# EAGLE design m1-ram (EAGLE 9.5.2)
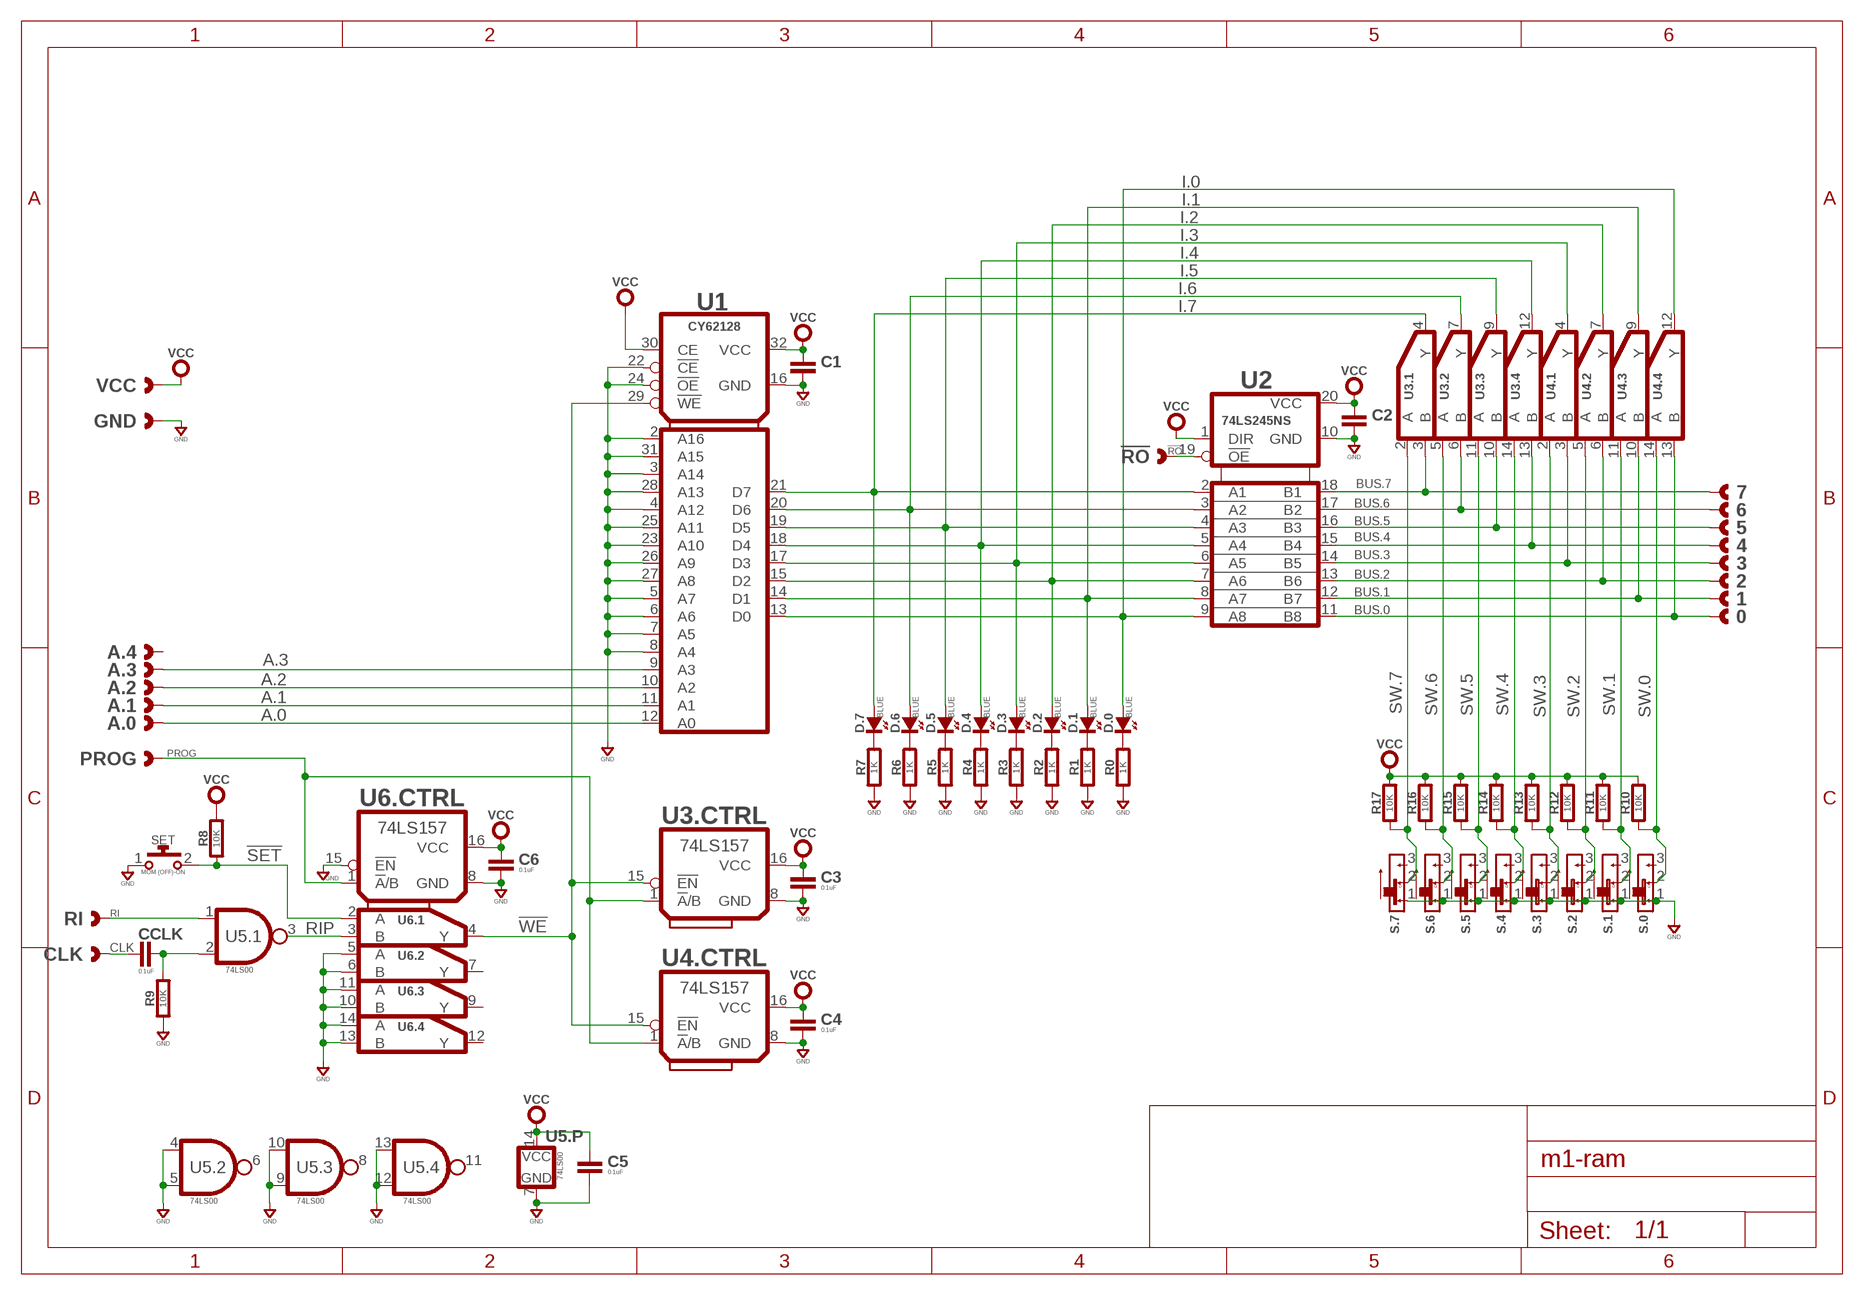
[diagram p0: schematic, sheet 1]

## Parts
0  CAST-01X1  [CAST01-2.54MM]
1  CAST-01X1  [CAST01-2.54MM]
2  CAST-01X1  [CAST01-2.54MM]
3  CAST-01X1  [CAST01-2.54MM]
4  CAST-01X1  [CAST01-2.54MM]
5  CAST-01X1  [CAST01-2.54MM]
6  CAST-01X1  [CAST01-2.54MM]
7  CAST-01X1  [CAST01-2.54MM]
!RO  CAST-01X1  [CAST01-2.54MM]
A.0  CAST-01X1  [CAST01-2.54MM]
A.1  CAST-01X1  [CAST01-2.54MM]
A.2  CAST-01X1  [CAST01-2.54MM]
A.3  CAST-01X1  [CAST01-2.54MM]
A.4  CAST-01X1  [CAST01-2.54MM]
C1  CAPACITOR0603  [0603-CAP]
C2  CAPACITOR0603  [0603-CAP]
C3  0.1uF  CAPACITOR0603  [0603-CAP]
C4  0.1uF  CAPACITOR0603  [0603-CAP]
C5  0.1uF  CAPACITOR0603  [0603-CAP]
C6  0.1uF  CAPACITOR0603  [0603-CAP]
CCLK  0.1uF  CAPACITOR0603  [0603-CAP]
CLK  CAST-01X1  [CAST01-2.54MM]
D.0  BLUE  SMT0603  [SMD_0603]
D.1  BLUE  SMT0603  [SMD_0603]
D.2  BLUE  SMT0603  [SMD_0603]
D.3  BLUE  SMT0603  [SMD_0603]
D.4  BLUE  SMT0603  [SMD_0603]
D.5  BLUE  SMT0603  [SMD_0603]
D.6  BLUE  SMT0603  [SMD_0603]
D.7  BLUE  SMT0603  [SMD_0603]
GND  CAST-01X1  [CAST01-2.54MM]
PROG  CAST-01X1  [CAST01-2.54MM]
R0  1K  RESISTOR0603  [0603-RES]
R1  1K  RESISTOR0603  [0603-RES]
R2  1K  RESISTOR0603  [0603-RES]
R3  1K  RESISTOR0603  [0603-RES]
R4  1K  RESISTOR0603  [0603-RES]
R5  1K  RESISTOR0603  [0603-RES]
R6  1K  RESISTOR0603  [0603-RES]
R7  1K  RESISTOR0603  [0603-RES]
R8  10K  RESISTOR0603  [0603-RES]
R9  10K  RESISTOR0603  [0603-RES]
R10  10K  RESISTOR0603  [0603-RES]
R11  10K  RESISTOR0603  [0603-RES]
R12  10K  RESISTOR0603  [0603-RES]
R13  10K  RESISTOR0603  [0603-RES]
R14  10K  RESISTOR0603  [0603-RES]
R15  10K  RESISTOR0603  [0603-RES]
R16  10K  RESISTOR0603  [0603-RES]
R17  10K  RESISTOR0603  [0603-RES]
RI  CAST-01X1  [CAST01-2.54MM]
S.0  SLIDE-SPDTJS102011JCQN  [CK_JS102011JCQN]
S.1  SLIDE-SPDTJS102011JCQN  [CK_JS102011JCQN]
S.2  SLIDE-SPDTJS102011JCQN  [CK_JS102011JCQN]
S.3  SLIDE-SPDTJS102011JCQN  [CK_JS102011JCQN]
S.4  SLIDE-SPDTJS102011JCQN  [CK_JS102011JCQN]
S.5  SLIDE-SPDTJS102011JCQN  [CK_JS102011JCQN]
S.6  SLIDE-SPDTJS102011JCQN  [CK_JS102011JCQN]
S.7  SLIDE-SPDTJS102011JCQN  [CK_JS102011JCQN]
SET  MOM (OFF)-ON  TACTILE-2PSMD  [SWITCH-0635-2P-SMD]
U1  CY62128  SRAM_128KX8CYPRESS  [SO32]
U2  74LS245NS  [SO20]
U3  74LS157  74LS157D  [SO16]
U4  74LS157  74LS157D  [SO16]
U5  74LS00  74LS00D  [SOP14]
U6  74LS157  74LS157D  [SO16]
VCC  CAST-01X1  [CAST01-2.54MM]

## Nets
!RO: !RO.1 U2.19(!OE)
!SET: R8.1 SET.2 U6.2(.1:A)
!WE: U1.29(!WE) U3.15(.CTRL:!EN) U4.15(.CTRL:!EN) U6.4(.1:Y)
A.0: A.0.1 U1.12(A0)
A.1: A.1.1 U1.11(A1)
A.2: A.2.1 U1.10(A2)
A.3: A.3.1 U1.9(A3)
BUS.0: 0.1 U2.11(B8) U4.13(.4:B)
BUS.1: 1.1 U2.12(B7) U4.10(.3:B)
BUS.2: 2.1 U2.13(B6) U4.6(.2:B)
BUS.3: 3.1 U2.14(B5) U4.3(.1:B)
BUS.4: 4.1 U2.15(B4) U3.13(.4:B)
BUS.5: 5.1 U2.16(B3) U3.10(.3:B)
BUS.6: 6.1 U2.17(B2) U3.6(.2:B)
BUS.7: 7.1 U2.18(B1) U3.3(.1:B)
CLK: CCLK.1 CLK.1
GND: C1.2 C2.2 C3.2 C4.2 C5.2 C6.2 GND.1 R0.1 R1.1 R2.1 R3.1 R4.1 R5.1 R6.1 R7.1 R9.1 S.0.1 S.1.1 S.2.1 S.3.1 S.4.1 S.5.1 S.6.1 S.7.1 SET.1 U1.2(A16) U1.3(A14) U1.4(A12) U1.5(A7) U1.6(A6) U1.7(A5) U1.8(A4) U1.16(GND) U1.22(!CE) U1.23(A10) U1.24(!OE) U1.25(A11) U1.26(A9) U1.27(A8) U1.28(A13) U1.31(A15) U2.10(GND) U3.8(.CTRL:GND) U4.8(.CTRL:GND) U5.4(.2:A) U5.5(.2:B) U5.7(.P:GND) U5.9(.3:B) U5.10(.3:A) U5.12(.4:B) U5.13(.4:A) U6.5(.2:A) U6.6(.2:B) U6.8(.CTRL:GND) U6.10(.3:B) U6.11(.3:A) U6.13(.4:B) U6.14(.4:A) U6.15(.CTRL:!EN)
I.0: D.0.A U1.13(D0) U2.9(A8) U4.12(.4:Y)
I.1: D.1.A U1.14(D1) U2.8(A7) U4.9(.3:Y)
I.2: D.2.A U1.15(D2) U2.7(A6) U4.7(.2:Y)
I.3: D.3.A U1.17(D3) U2.6(A5) U4.4(.1:Y)
I.4: D.4.A U1.18(D4) U2.5(A4) U3.12(.4:Y)
I.5: D.5.A U1.19(D5) U2.4(A3) U3.9(.3:Y)
I.6: D.6.A U1.20(D6) U2.3(A2) U3.7(.2:Y)
I.7: D.7.A U1.21(D7) U2.2(A1) U3.4(.1:Y)
N$13: D.0.K(C) R0.2
N$16: CCLK.2 R9.2 U5.2(.1:B)
N$38: D.1.K(C) R1.2
N$39: D.2.K(C) R2.2
N$40: D.3.K(C) R3.2
N$41: D.4.K(C) R4.2
N$42: D.5.K(C) R5.2
N$43: D.6.K(C) R6.2
N$44: D.7.K(C) R7.2
PROG: PROG.1 U3.1(.CTRL:!A!/B) U4.1(.CTRL:!A!/B) U6.1(.CTRL:!A!/B)
RI: RI.1 U5.1(.1:A)
RIP: U5.3(.1:Y) U6.3(.1:B)
SW.0: R10.1 S.0.2 U4.14(.4:A)
SW.1: R11.1 S.1.2 U4.11(.3:A)
SW.2: R12.1 S.2.2 U4.5(.2:A)
SW.3: R13.1 S.3.2 U4.2(.1:A)
SW.4: R14.1 S.4.2 U3.14(.4:A)
SW.5: R15.1 S.5.2 U3.11(.3:A)
SW.6: R16.1 S.6.2 U3.5(.2:A)
SW.7: R17.1 S.7.2 U3.2(.1:A)
VCC: C1.1 C2.1 C3.1 C4.1 C5.1 C6.1 R8.2 R10.2 R11.2 R12.2 R13.2 R14.2 R15.2 R16.2 R17.2 U1.30(CE) U1.32(VCC) U2.1(DIR) U2.20(VCC) U3.16(.CTRL:VCC) U4.16(.CTRL:VCC) U5.14(.P:VCC) U6.16(.CTRL:VCC) VCC.1
Unconnected: A.4.1 S.0.3 S.1.3 S.2.3 S.3.3 S.4.3 S.5.3 S.6.3 S.7.3 U5.6(.2:Y) U5.8(.3:Y) U5.11(.4:Y) U6.7(.2:Y) U6.9(.3:Y) U6.12(.4:Y)

## Library data of the parts
0 1-7 !RO A.0 A.1-A.4 CLK GND PROG RI VCC = con-headers:CAST-01X1: Castelated Edge Hole Pad
C1-C6 CCLK = rlc:CAPACITOR: Capacitor CAP
D.0 D.1-D.7 = led:SMT: LED SMT
R0 R1-R17 = rlc:RESISTOR: Resistor
S.0 S.1-S.7 = switch-smd:SLIDE-SPDT: Slide Switch - SPDT
SET = switch-smd:TACTILE-2P: Pushbutton Switch, 2 pin, SPST, PCB Mount, THD; MFR: CK Switch; MPN: PTS635S*SMTR; MPN2: Pololu #1400
U1 = logic:SRAM_128KX8: SRAM 128K x 8; MFR: Cypress; MPN: CY62128ELL-45SXI
U2 = logic:74*245?: 74245 Octal Transceiver
U3 U4 U6 = logic:74*157?: 74*157 Multiplexor/Line-Selector 4-ch; MPN: 74LS157D
U5 = logic:74*00?: Quad Nand Gate; MPN: 74LS00N

## Board
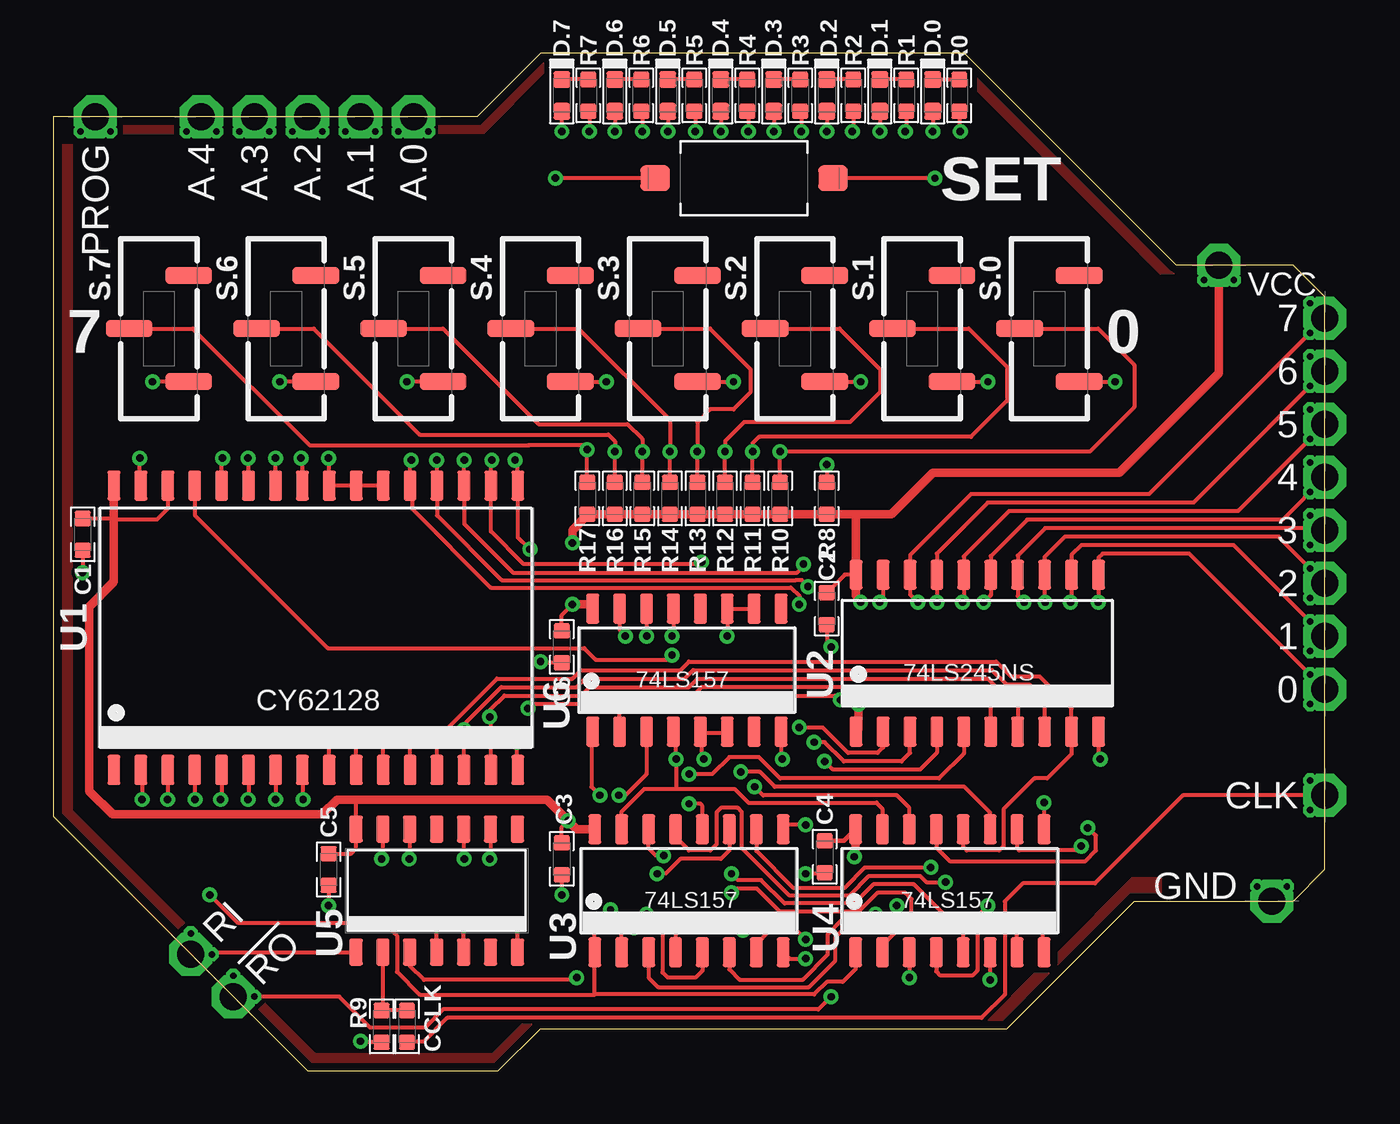
[diagram p1: board, top side]
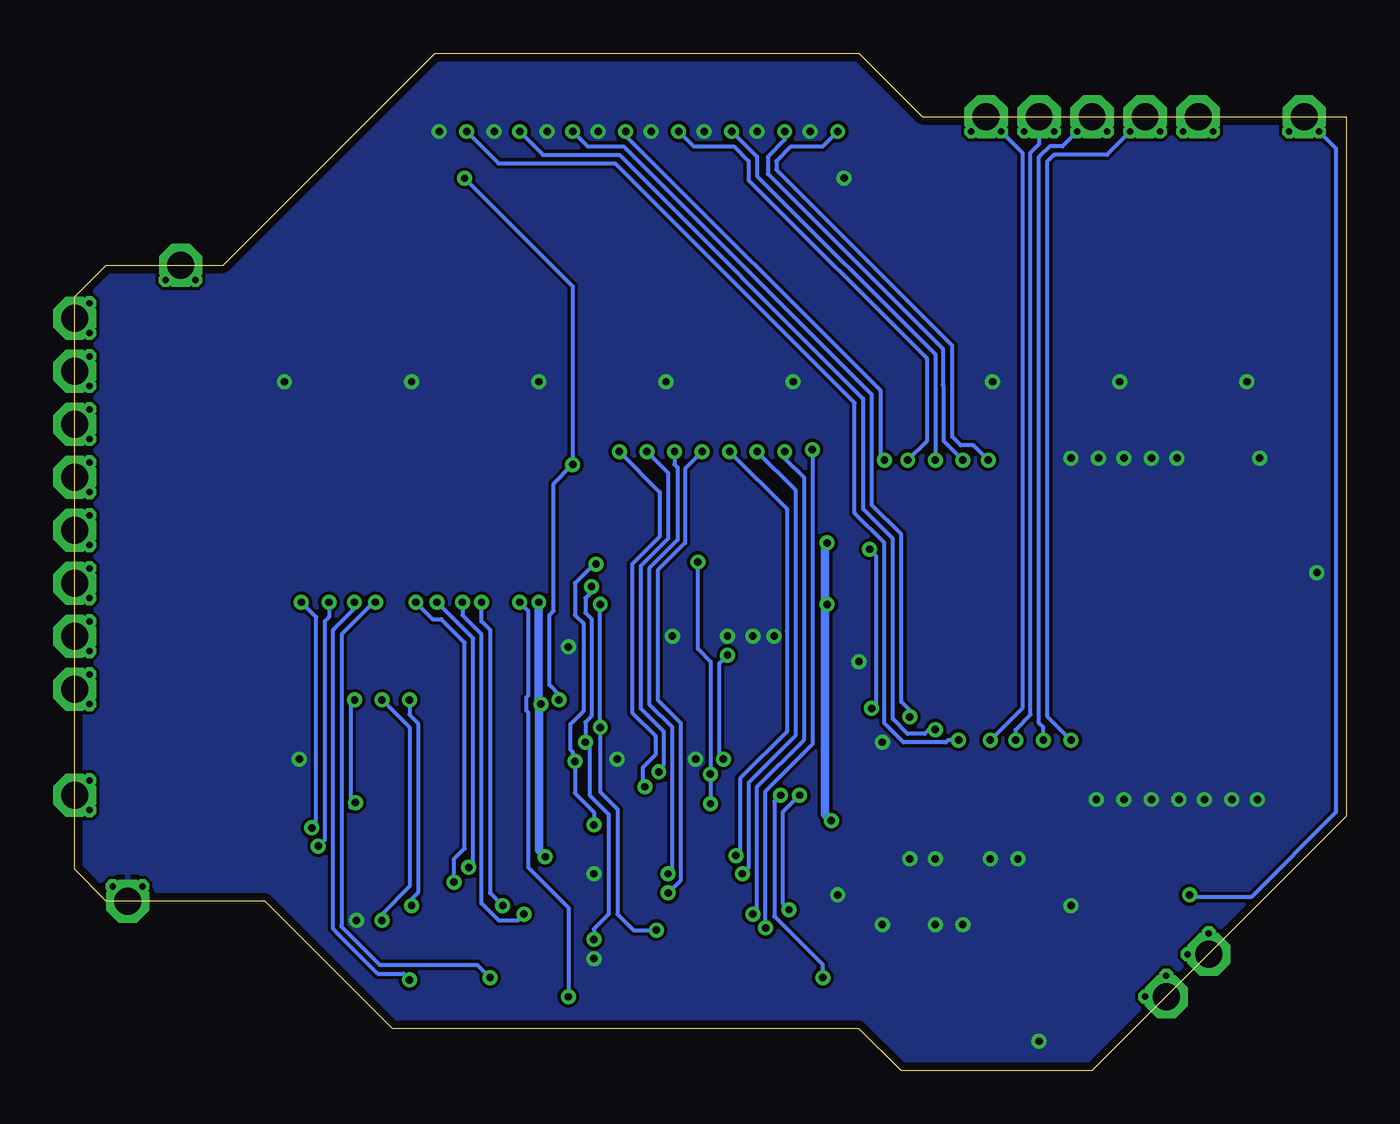
[diagram p2: board, bottom side, seen from below]

Size 60 x 48 mm. Coordinates in mm from the lower left corner, seen from the top.
Outline: 0,12 12,0 21,0 23,2 45,2 51,8 58.5,8 60,9.5 60,36.5 58.5,38 53,38 43,48 23,48 20,45 0,45 0,12
Copper layers (1*16): Top 0.0356mm / dielectric 1.5011mm / Bottom 0.0356mm
Design rules "OSH-CircuitMonkey *": minimum track width 6mil, minimum drill 12mil, track to track 6mil, track to pad 6mil, pad to pad 6mil, via to via 6mil, smd to smd 6mil, copper to edge 15mil, drill to drill 6mil, minimum pad ring 7mil, minimum via ring 7mil, stop-mask expansion 3mil, vias tented up to drill 14mil, thermal gap 10mil

### Footprints (pad centres in the part's own frame; a part is rotated, then mirrored left to right if it is on the bottom)
CAST01-2.54MM = drill 1.27 pad 2.032 octagon: 1 0,0 | drill 0.305 octagon: P$1 -0.7,0.7; P$2 -0.7,-0.7
0603-CAP = smd 0.711 x 0.762: 1 -0.752,0; 2 0.752,0
SMD_0603 = smd 0.8 x 0.8: A 0.75,0; K -0.75,0
0603-RES = smd 0.711 x 0.762: 1 -0.752,0; 2 0.752,0
CK_JS102011JCQN = smd 0.8 x 2.2: 1 -2.5,-1.4; 2 0,1.4; 3 2.5,-1.4
SWITCH-0635-2P-SMD = smd 1.4 x 1.2: 1 -4.2,0; 2 4.2,0
SO32 = smd 0.6 x 1.4: 1 -9.525,-6.7; 2 -8.255,-6.7; 3 -6.985,-6.7; 4 -5.715,-6.7; 5 -4.445,-6.7; 6 -3.175,-6.7; 7 -1.905,-6.7; 8 -0.635,-6.7; 9 0.635,-6.7; 10 1.905,-6.7; 11 3.175,-6.7; 12 4.445,-6.7; 13 5.715,-6.7; 14 6.985,-6.7; 15 8.255,-6.7; 16 9.525,-6.7; 17 9.525,6.7; 18 8.255,6.7; 19 6.985,6.7; 20 5.715,6.7; 21 4.445,6.7; 22 3.175,6.7; 23 1.905,6.7; 24 0.635,6.7; 25 -0.635,6.7; 26 -1.905,6.7; 27 -3.175,6.7; 28 -4.445,6.7; 29 -5.715,6.7; 30 -6.985,6.7; 31 -8.255,6.7; 32 -9.525,6.7
SO20 = smd 0.6 x 1.4: 1 -5.715,-3.7; 2 -4.445,-3.7; 3 -3.175,-3.7; 4 -1.905,-3.7; 5 -0.635,-3.7; 6 0.635,-3.7; 7 1.905,-3.7; 8 3.175,-3.7; 9 4.445,-3.7; 10 5.715,-3.7; 11 5.715,3.7; 12 4.445,3.7; 13 3.175,3.7; 14 1.905,3.7; 15 0.635,3.7; 16 -0.635,3.7; 17 -1.905,3.7; 18 -3.175,3.7; 19 -4.445,3.7; 20 -5.715,3.7
SO16 = smd 0.6 x 1.4: 1 -4.445,-2.9; 2 -3.175,-2.9; 3 -1.905,-2.9; 4 -0.635,-2.9; 5 0.635,-2.9; 6 1.905,-2.9; 7 3.175,-2.9; 8 4.445,-2.9; 9 4.445,2.9; 10 3.175,2.9; 11 1.905,2.9; 12 0.635,2.9; 13 -0.635,2.9; 14 -1.905,2.9; 15 -3.175,2.9; 16 -4.445,2.9
SOP14 = smd 1.27 x 0.635: 1 -2.9,3.81; 2 -2.9,2.54; 3 -2.9,1.27; 4 -2.9,0; 5 -2.9,-1.27; 6 -2.9,-2.54; 7 -2.9,-3.81; 8 2.9,-3.81; 9 2.9,-2.54; 10 2.9,-1.27; 11 2.9,0; 12 2.9,1.27; 13 2.9,2.54; 14 2.9,3.81

### Placement (x,y rotation side)
0  60,18 0 top
1  60,20.5 0 top
2  60,23 0 top
3  60,25.5 0 top
4  60,28 0 top
5  60,30.5 0 top
6  60,33 0 top
7  60,35.5 0 top
!RO  8.5,3.5 225 top
A.0  17,45 90 top
A.1  14.5,45 90 top
A.2  12,45 90 top
A.3  9.5,45 90 top
A.4  7,45 90 top
C1  1.4,25.3 270 top
C2  36.5,21.8 270 top
C3  24,10 270 top
C4  36.4,10.1 270 top
C5  13,9.5 270 top
C6  24,20 270 top
CCLK  16.7,2.1 90 top
CLK  60,13 0 top
D.0  41.5,46 270 top
D.1  39,46 270 top
D.2  36.5,46 270 top
D.3  34,46 270 top
D.4  31.5,46 270 top
D.5  29,46 270 top
D.6  26.5,46 270 top
D.7  24,46 270 top
GND  57.5,8 270 top
PROG  2,45 90 top
R0  42.75,46 90 top
R1  40.25,46 90 top
R2  37.75,46 90 top
R3  35.25,46 90 top
R4  32.75,46 90 top
R5  30.25,46 90 top
R6  27.75,46 90 top
R7  25.25,46 90 top
R8  36.5,27 270 top
R9  15.5,2.1 90 top
R10  34.3,27 270 top
R11  33,27 270 top
R12  31.7,27 270 top
R13  30.4,27 270 top
R14  29.1,27 270 top
R15  27.8,27 270 top
R16  26.5,27 270 top
R17  25.2,27 270 top
RI  6.5,5.5 225 top
S.0  47,35 90 top
S.1  41,35 90 top
S.2  35,35 90 top
S.3  29,35 90 top
S.4  23,35 90 top
S.5  17,35 90 top
S.6  11,35 90 top
S.7  5,35 90 top
SET  32.6,42.1 0 top
U1  12.4,20.9 0 top
U2  43.6,19.7 0 top
U3  30,8.5 0 top
U4  42.3,8.5 0 top
U5  18.1,8.5 90 top
U6  29.9,18.9 0 top
VCC  55,38 90 top

### Tracks (layer width: path | path; a pad name or v marks a point on that pad's centre or on a via)
!RO  (via drill 0.35)
  Top 0.2: U2.19 39.16,22.25 v39,22.1 | v36.7,3.5 36.1,2.9 18.4,2.9 17.54,2.04 14.96,2.04 13.5,3.5 !RO.1
  Bottom 0.2: v39,22.1 38.6,21.7 38.6,17.7 38.7,17.6 38.7,17 38.6,16.9 38.6,9.6 36.7,7.7 v36.7,3.5
!SET  (via drill 0.35)
  Top 0.2: v36.5,28.59 R8.1 | SET.2 v41.6,42.09 | U6.2 26.73,17.02 27,17.3 30.4,17.3 30.8,17.7 36.9,17.7 37.1,17.5 v37.15,17.5
  Bottom 0.2: v41.6,42.09 v41.59,42.09 36.5,37 v36.5,28.6 | v36.5,28.6 v36.5,28.59 | v37.15,17.5 37.15,17.75 37.6,18.2 37.6,21.5 37.4,21.7 37.4,27.7 v36.5,28.6
!WE  (via drill 0.35)
  Top 0.2: U1.29 6.68,26.21 12.96,19.94 25.06,19.94 25.6,19.4 29.2,19.4 v29.2,19.61 | U3.15 26.82,12.22 27.9,13.3 29.4,13.3 | U6.4 29.39,15.87 v29.39,14.7 29.39,13.3 29.4,13.3 | 29.4,13.3 30.34,13.3 30.35,13.3 32.14,13.3 32.8,12.65 38.85,12.65 39.12,12.38 U4.15
  Bottom 0.2: v29.2,19.61 29.6,19.2 29.6,14.9 v29.39,14.7
A.0  (via drill 0.35)
  Top 0.2: U1.12 16.84,15.55 v16.8,15.6
  Bottom 0.2: v16.8,15.6 15.3,17.1 15.3,43.3 A.0.1
A.1  (via drill 0.35)
  Top 0.2: U1.11 15.57,15.57 v15.6,15.6
  Bottom 0.2: v15.6,15.6 15.6,16.1 14.9,16.8 14.9,43.3 14.5,43.7 A.1.1
A.2  (via drill 0.35)
  Top 0.2: U1.10 v14.3,15.6
  Bottom 0.2: v14.3,15.6 14.3,16.2 14.5,16.4 14.5,43.1 14,43.6 13.4,43.6 A.2.1
A.3  (via drill 0.35)
  Top 0.2: U1.9 13.04,15.56 v13,15.6
  Bottom 0.2: v13,15.6 14.1,16.7 14.1,42.9 13.8,43.2 11.3,43.2 A.3.1
AAA
  pour Top: 43.6,46.9 43.6,46.2 52.2,37.6 52.9,37.6
BBB
  pour Top: 23.15,47.55 23.15,47.05 20.3,44.2 18.2,44.2 18.2,44.6 20.2,44.6
BUS.0  (via drill 0.35)
  Top 0.2: 0.1 53.6,24.4 49.52,24.4 49.31,24.2 U2.11 49.31,22.11 v49.3,22.1 | U4.13 41.66,10.54 42.3,9.9 48.7,9.9 49.2,10.4 49.2,11.1 48.82,11.48 v48.8,11.46
  Bottom 0.2: v49.3,22.1 48.6,21.4 48.6,11.66 v48.8,11.46
BUS.1  (via drill 0.35)
  Top 0.2: 1.1 55.7,24.8 48.51,24.8 48.05,24.33 U2.12 48.05,22.14 v48,22.1 | v48.5,10.6 48.3,10.4 45.58,10.4 45.48,10.5 U4.10
  Bottom 0.2: v48,22.1 48,21.4 48.2,21.2 48.2,10.9 v48.5,10.6
BUS.2  (via drill 0.35)
  Top 0.2: 2.1 57.8,25.2 47.74,25.2 46.77,24.23 U2.13 46.77,22.12 v46.8,22.1 | U4.6 44.2,4.5 v44.2,4.29
  Bottom 0.2: v46.8,22.1 46.8,21.8 47.8,20.8 47.8,6.7 47.66,6.56 47.57,6.46 47.56,6.46 45.7,4.59 44.5,4.59 v44.2,4.29
BUS.3  (via drill 0.35)
  Top 0.2: 3.1 59.9,25.6 46.8,25.6 45.51,24.3 U2.14 45.51,22.39 v45.8,22.1 | U4.3 v40.4,4.4
  Bottom 0.2: v45.8,22.1 45.9,22.1 47.4,20.6 47.4,6.9 47.41,6.8 45.6,5 41,5 v40.4,4.4
BUS.4  (via drill 0.35)
  Top 0.2: 4.1 58,26 45.96,26 44.23,24.28 U2.15 44.23,22.43 v43.9,22.1 | U3.13 29.36,11.04 30,10.4 31,10.4 31.3,10.7 31.3,12.2 31.5,12.4 32.3,12.4 32.5,12.2 32.5,10.5 34.7,8.29 37.59,8.29 38.5,9.2 40.9,9.2 41.2,8.9 v42.1,8.9
  Bottom 0.2: v43.9,22.1 43.1,21.3 42.7,21.3 41.6,20.2 41.6,10.5 42.1,10 v42.1,8.9
BUS.5  (via drill 0.35)
  Top 0.2: 5.1 55.9,26.4 45.1,26.4 42.97,24.27 U2.16 42.97,22.16 v42.9,22.1 | U3.10 33.17,10.37 34.9,8.65 37.35,8.65 38.3,9.6 v41.41,9.6
  Bottom 0.2: v42.9,22.1 41.2,20.4 41.2,9.8 v41.41,9.6
BUS.6  (via drill 0.35)
  Top 0.2: 6.1 53.8,26.8 44.1,26.8 41.7,24.39 U2.17 v41.7,22.11 v41.7,22.1 | U3.6 31.91,4.79 32.39,4.31 35.37,4.31 36.55,5.49 36.55,6.45 37.2,7.1 38.5,7.1 v38.8,7.4 v38.8,7.39
  Bottom 0.2: v41.7,22.1 41.7,21.5 40.8,20.6 40.8,7.9 39.99,7.09 39.1,7.09 v38.8,7.39
BUS.7  (via drill 0.35)
  Top 0.2: 7.1 51.7,27.2 43.3,27.2 40.42,24.32 U2.18 40.42,22.48 v40.8,22.1 | U3.3 28.09,4.41 28.54,3.96 35.66,3.96 36.9,5.2 36.9,6.3 37.3,6.7 39.26,6.7 39.8,7.24 v39.8,7.79
  Bottom 0.2: v40.8,22.1 40.8,21.2 40.4,20.8 40.4,8.39 v39.8,7.79
CCC
  pour Top: 3.3,44.6 3.3,44.2 5.7,44.2 5.7,44.6
CLK
  Top 0.2: CLK.1 53.3,13 49.15,8.85 45.75,8.85 44.9,8 44.9,3.6 43.8,2.5 18.6,2.5 17.5,1.4 16.75,1.4 CCLK.1
DDD
  pour Top: 0.4,43.7 0.9,43.7 0.9,12.3 6.2,7 5.85,6.65 0.4,12.1
EEE
  pour Top: 9.7,2.9 12.2,0.4 20.8,0.4 22.6,2.2 22.1,2.2 20.7,0.8 12.4,0.8 10,3.2
FFF
  pour Top: 44.1,2.4 44.8,2.4 47,4.6 46.3,4.6
  pour Top: 47.4,5.6 47.4,5 50.8,8.4 52.3,8.4 52.3,9.1 50.9,9.1
GND  (via drill 0.35)
  Top 0.2: U1.2 4.2,14.14 v4.2,12.8 | U1.3 5.42,12.81 v5.4,12.8 | U1.4 6.68,12.81 v6.7,12.8 | U1.5 7.96,12.86 v7.9,12.8 | U1.6 9.22,12.82 v9.2,12.8 | U1.7 v10.49,12.8 v10.5,12.8 | U1.8 11.77,12.84 v11.8,12.8 | U1.28 7.96,28.86 v8,28.9 | U1.27 9.22,28.88 v9.2,28.9 | U1.26 v10.49,28.89 v10.5,28.9 | U1.25 11.77,28.84 v11.7,28.9 | v13,28.9 13.04,28.86 U1.24 U1.23 U1.22 | U1.31 4.1,27.64 v4.1,28.9 | S.7.1 v4.7,32.5 | S.6.1 v10.7,32.5 | S.5.1 v16.7,32.5 | S.4.1 v26.1,32.5 | S.3.1 v32.1,32.5 | S.2.1 v38.1,32.5 | S.1.1 v44.1,32.5 | S.0.1 v50.1,32.5 | R7.1 25.3,45.2 v25.3,44.3 | R6.1 27.8,45.2 v27.8,44.3 | R5.1 30.3,45.2 v30.3,44.3 | R4.1 32.8,45.2 v32.8,44.3 | R3.1 35.3,45.2 v35.3,44.3 | R2.1 37.75,44.35 v37.7,44.3 | R1.1 40.25,44.35 v40.2,44.3 | R0.1 42.75,44.35 v42.8,44.3 | SET.1 v23.7,42.1 | U2.10 49.31,14.8 49.4,14.71 v49.4,14.7 | U4.8 46.7,5.64 v46.7,7.1 | U5.4 v18.1,6.9 | U5.5 19.37,6.87 v19.4,6.9 | U5.7 v21.91,6.89 v21.9,6.9 | C3.2 v24,8.3 | U5.12 16.83,10.03 v16.8,10 | U5.13 15.56,10.06 v15.5,10 | C5.2 v13,7.8 | U5.10 19.37,10.03 v19.4,10 | U5.9 20.64,10.04 v20.6,10 | U1.16 21.9,14.22 v21.9,15.5 | C6.2 23.05,19.25 v23,19.3 | C4.2 36.35,9.3 v35.5,9.3 | U3.8 34.74,5.3 v35.5,5.3 | U6.5 30.6,15.94 | 30.6,15.94 30.6,14.8 v30.7,14.7 | U6.8 34.34,14.76 v34.4,14.7 | v36.7,20 36.5,20.2 C2.2 | U6.15 26.73,20.8 27,20.52 v27,20.5 | U6.14 v28,20.5 | U6.13 29.27,20.57 v29.2,20.5 | v31.8,20.5 U6.11 U6.10 | U6.6 31.74,15.94 30.6,15.94 | C1.2 v1.4,23.5 | R9.1 14.55,1.35 v14.5,1.4
  pour Bottom: 12,0 0,12 0,45 20,45 23,48 43,48 53,38 59,38 60,37 60,10 58,8 51,8 45,2 23,2 21,0
I.0  (via drill 0.35)
  Top 0.2: U1.13 18.11,15.41 v18.3,15.6 18.3,15.86 20.94,18.5 24.5,18.5 24.9,18.9 29.6,18.9 30,19.3 44.5,19.3 45.2,18.6 46.55,18.6 48.05,17.1 U2.9 48.05,14.95 46.9,13.8 46.3,13.8 44.84,12.34 44.84,10.6 44.63,10.4 43.1,10.4 42.94,10.56 U4.12 | D.0.A v41.5,44.3
  Bottom 0.2: v18.3,15.6 18.8,15.6 18.91,15.49 20.89,15.49 21.8,16.4 21.8,24.9 23.2,26.3 23.2,31.5 34.5,42.8 40,42.8 v41.5,44.3
I.1  (via drill 0.35)
  Top 0.2: U1.14 19.39,16.09 v19.4,16.1 19.4,16.36 21.14,18.1 24.7,18.1 25.1,18.5 29.8,18.5 30.2,18.9 44.3,18.9 45,18.2 46.09,18.2 v46.79,17.5 46.79,15.99 | 46.8,15.97 46.79,15.99 | 46.79,15.99 U2.8 | D.1.A v39,44.3 | v46.75,12.65 v46.74,12.64 U4.9
  Bottom 0.2: v19.4,16.1 19.7,16.1 19.9,15.9 20.7,15.9 21.4,16.6 21.4,25.1 22.8,26.5 22.8,31.7 34.3,43.2 37.9,43.2 v39,44.3 | v46.79,17.5 46.99,17.3 46.99,12.41 v46.75,12.65
I.2  (via drill 0.35)
  Top 0.2: U1.15 20.66,16.64 v20.6,16.7 20.6,17 21.3,17.7 24.9,17.7 25.3,18.1 30,18.1 30.4,18.5 44.1,18.5 45.1,17.5 v45.5,17.5 v45.51,17.5 U2.7 | U4.7 45.48,6.97 45.5,7 v45.5,7.1 | D.2.A v36.5,44.3
  Bottom 0.2: v20.6,16.7 20.6,17 21,17.4 21,25.3 22.4,26.7 22.4,31.9 34.1,43.6 35.8,43.6 v36.5,44.3 | v45.5,7.1 45.5,7.4 44.2,8.7 44.2,16.2 v45.5,17.5
I.3  (via drill 0.35)
  Top 0.2: v21.8,28.8 21.9,28.8 21.93,28.77 U1.17 21.93,25.18 v22.5,24.6 | U2.6 44.23,17.46 v44.2,17.5 44.2,17.9 43.99,18.11 30.61,18.11 30.2,17.7 25.5,17.7 25.1,17.3 22.61,17.3 v22.41,17.09 | U4.4 41.66,4.7 41.87,4.5 43.37,4.5 43.6,4.74 43.6,7.3 v44.1,7.8 | D.3.A v34,44.3
  Bottom 0.2: v21.8,28.8 22,29 22,32.09 34,44.1 v34,44.3 | v44.1,7.8 44.1,8.1 43.8,8.4 43.8,16.4 44.2,16.8 v44.2,17.5 | v22.5,24.6 22.2,24.3 22.2,17.3 v22.41,17.09
I.4  (via drill 0.35)
  Top 0.2: v20.7,28.8 20.66,28.75 U1.18 20.66,25.45 22.2,23.9 30.5,23.9 v30.6,24 | v30,12.6 30.54,12.6 30.64,12.5 U3.12 | D.4.A v31.5,44.3 | U2.5 42.97,14.96 41.8,13.8 34.3,13.8 33.3,14.8 31.9,14.8 31.09,13.99 30.45,13.99 30.44,14 v30,14
  Bottom 0.2: v20.7,28.8 19.8,29.7 19.8,33.6 28.2,42 28.2,42.9 28.9,43.6 30.8,43.6 v31.5,44.3 | v30,14 30,19.3 30.6,19.9 v30.6,24 | v30,14 v30,12.6 | v30,14
I.5  (via drill 0.35)
  Top 0.2: v19.4,28.8 19.39,28.79 U1.19 19.4,27.58 19.4,25.8 21.7,23.5 35.1,23.5 35.4,23.8 v35.4,23.9 | D.5.A v29,44.3 | U2.4 41.7,15 40.9,14.21 36.8,14.21 v36.4,14.6 | v35.51,11.6 34.65,11.6 U3.9
  Bottom 0.2: v19.4,28.8 19.4,33.8 27.8,42.2 27.8,43.1 v29,44.3 | v35.51,11.6 v35.5,11.6 35.5,12.2 36.4,13.1 v36.4,14.6 36.5,14.7 36.5,15.04 36.6,15.15 36.6,16.35 36,16.96 36,21.1 36.4,21.5 36.4,23 35.5,23.9 v35.4,23.9
I.6  (via drill 0.35)
  Top 0.2: v18.1,28.8 18.11,28.79 U1.20 18.11,26.2 21.17,23.15 35.05,23.15 35.06,23.14 35.31,23.14 v35.61,22.84 | U3.7 33.17,5.97 33.8,6.6 35.1,6.6 v35.5,6.2 | v35.9,15.5 36.4,15.5 37.3,14.6 40.02,14.6 40.42,15 U2.3 | D.6.A v26.5,44.3
  Bottom 0.2: v18.1,28.8 19,29.7 19,32.3 19.05,32.35 19.05,34.05 27.3,42.3 27.3,43.1 26.5,43.9 v26.5,44.3 | v35.5,6.2 35.5,6.7 34.8,7.4 34.8,12.1 35.7,13 35.7,15.3 v35.9,15.5 35.9,16.44 35.61,16.73 35.61,21.31 35.9,21.6 35.9,22.3 35.6,22.6 v35.61,22.84
I.7  (via drill 0.35)
  Top 0.2: v16.9,28.8 16.84,28.75 U1.21 16.95,27.5 16.95,26.5 20.65,22.8 34.8,22.8 35.2,22.4 v35.2,22 | D.7.A v24,44.3 | U2.2 39.16,15.26 38.9,15 37.5,15 36.3,16.2 v35.2,16.2 | U3.4 29.36,6.43 29.57,6.64 v32.55,6.64
  Bottom 0.2: v16.9,28.8 17.6,29.5 18.2,29.5 18.6,29.9 18.6,34.2 26.9,42.5 26.9,42.9 26.2,43.6 24.7,43.6 v24,44.3 | v35.2,22 v35.2,16.2 35.2,13.16 34.4,12.35 34.4,7.39 33.64,6.64 v32.55,6.64
N$13
  Top 0.2: R0.2 D.0.K
N$16
  Top 0.2: U5.2 15.56,2.91 R9.2 CCLK.2
N$38
  Top 0.2: R1.2 D.1.K
N$39
  Top 0.2: R2.2 D.2.K
N$40
  Top 0.2: R3.2 D.3.K
N$41
  Top 0.2: R4.2 D.4.K
N$42
  Top 0.2: R5.2 D.5.K
N$43
  Top 0.2: R6.2 D.6.K
N$44
  Top 0.2: R7.2 D.7.K
PROG  (via drill 0.35)
  Top 0.2: v7.4,8.3 8.7,7 15.61,7 16.23,6.38 16.23,4.67 17.3,3.6 25.55,3.6 | 25.55,3.6 U3.1 25.55,6.8 26.3,7.54 v26.3,7.6 | U4.1 37.85,4.8 37.26,4.2 36.5,4.2 35.91,3.6 25.55,3.6 | v25.8,13 25.4,13.4 25.4,15.95 U6.1
  Bottom 0.2: PROG.1 0.5,43.5 0.5,12.2 4.5,8.2 7.4,8.2 v7.4,8.3 | v25.8,13 26.6,12.2 26.6,7.9 v26.3,7.6
RI
  Top 0.2: RI.1 6.6,5.6 U5.1
RIP  (via drill 0.35)
  Top 0.2: U6.3 28,13.99 27,13 v26.7,13 | v24.7,4.4 24.6,4.3 17.5,4.3 16.83,4.97 U5.3
  Bottom 0.2: v26.7,13 27,12.7 27,7.29 24.7,5 v24.7,4.4
SW.0  (via drill 0.35)
  Top 0.2: R10.1 v34.3,29.2 48.9,29.2 51,31.3 51,33.3 49.3,35 S.0.2 | U4.14 40.4,12.4 39.8,13 33.5,13 v33.1,13.4
  Bottom 0.2: v34.3,29.2 32.4,27.3 32.4,25.2 33.7,23.9 33.7,16.9 32.6,15.8 32.6,14.9 33.2,14.3 33.2,13.4 v33.1,13.4
SW.1  (via drill 0.35)
  Top 0.2: R11.1 v33,29.2 33,29.6 33.3,29.91 43.3,29.91 45,31.6 45,33.2 43.2,35 S.1.2 | U4.11 44.2,12.2 43,13.4 34.05,13.4 33.34,14.11 v32.44,14.11
  Bottom 0.2: v33,29.2 32,28.2 32,25.1 33.3,23.8 33.3,17.1 32.2,16 32.2,14.44 32.43,14.21 v32.44,14.11
SW.2  (via drill 0.35)
  Top 0.2: S.2.2 37.1,35 39,33.1 39,32 37.6,30.6 32.6,30.6 31.7,29.7 v31.7,29.2 R12.1 | U4.5 42.94,6.46 40.6,8.8 38.7,8.8 37.8,7.9 34.51,7.9 33.41,9 32.3,9 v32.01,9.3
  Bottom 0.2: v31.7,29.2 31.7,28.6 31.55,28.45 31.55,25.05 32.9,23.7 32.9,17.3 31.8,16.2 31.8,9.51 v32.01,9.3
SW.3  (via drill 0.35)
  Top 0.2: S.3.2 31,35 32.9,33.1 32.9,32 32.1,31.2 31,31.2 30.4,30.6 v30.4,29.2 R13.1 | U4.2 39.12,5.92 40.5,7.3 40.5,8.1 40.2,8.4 38.9,8.4 38,7.5 34.3,7.5 33.2,8.6 32.2,8.6 v32,8.4
  Bottom 0.2: v30.4,29.2 31.2,28.4 31.2,24.9 32.5,23.6 32.5,17.5 31.4,16.4 31.4,9 v32,8.4
SW.4  (via drill 0.35)
  Top 0.2: S.4.2 24.8,35 29.1,30.7 v29.1,29.2 R14.1 | v28.8,10.16 28.44,10.16 28.09,10.51 U3.14
  Bottom 0.2: v29.1,29.2 26.4,26.5 26.4,20.76 26.39,20.75 26.39,16 28.6,13.8 28.6,10.2 28.64,10.16 v28.8,10.16
SW.5  (via drill 0.35)
  Top 0.2: S.5.2 18.4,35 22.9,30.5 27.1,30.5 27.8,29.8 v27.8,29.2 R15.1 | U3.11 31.91,10.4 31.5,10 29.6,10 28.9,9.3 v28.5,9.3
  Bottom 0.2: v27.8,29.2 26,27.4 26,15.8 28.2,13.6 28.2,9.6 v28.5,9.3
SW.6  (via drill 0.35)
  Top 0.2: S.6.2 12.3,35 17.3,30 26.2,30 26.5,29.7 v26.5,29.2 R16.1 | U3.5 30.64,4.74 30.3,4.4 29,4.4 28.75,4.65 28.75,6.66 v28,7.4
  Bottom 0.2: v26.5,29.2 26.5,28.9 25.6,28 25.6,15.6 27.8,13.4 27.8,7.61 v28,7.4
SW.7  (via drill 0.35)
  Top 0.2: S.7.2 6.6,35 12.1,29.5 22.45,29.5 25,29.5 v25.2,29.3 R17.1 | U3.2 26.82,6.53 27,6.7 27.36,6.7 v27.4,6.74
  Bottom 0.2: v25.2,29.3 25.2,15.4 27.4,13.2 v27.4,6.74
VCC  (via drill 0.35)
  Top 0.2: U2.20 37.35,23.4 C2.1 | U1.32 2.88,27.53 | U1.30 5.42,26.52 4.9,26 2.88,26 2.82,26.05 C1.1 | 14.3,12.8 14.29,12.79 U5.14 14.29,10.49 14.05,10.25 C5.1 | C3.1 24,11.5 v24.3,11.8 | C6.1 24,21.5 v24.5,22
  Top 0.203: U4.16 37.31,10.85 C4.1
  Top 0.4: 38,26.25 R8.2 R10.2 R11.2 R12.2 R13.2 R14.2 R15.2 R16.2 R17.2 25.2,26.2 24.5,25.5 v24.5,24.9 | 38,26.25 39.55,26.25 41.5,28.2 50.3,28.2 55,32.9 VCC.1 | 38,26.25 37.88,26.13 U2.20 37.88,22.41 38.1,22.2 v38.1,22.1 | v38,17.3 38,16.11 U2.1 | U4.16 37.85,10.16 v37.8,10.1 | v24.5,22 25.25,22 U6.16 | U3.16 24.7,11.4 v24.3,11.8 23.3,12.8 14.3,12.8 13.4,12.8 12.69,12.1 2.81,12.1 1.7,13.2 1.7,21.9 2.88,23.07 2.88,26 U1.32
  Bottom 0.4: v38.1,22.1 38.1,17.4 v38,17.3 38.09,17.2 38.09,10.4 v37.8,10.1 | v24.5,24.9 24.6,24.8 24.6,22.1 v24.5,22 24.6,21.9 24.6,12.1 v24.3,11.8

### Text on the board
tPlace: 7 | 0
Reference: PROG | A.5 | A.3 | A.2 | A.1 | A.0 | Vcc | 7 | 6 | 5 | 4 | 3 | 2 | 1 | 0 | CLK | GND | RI | !RO